# EAGLE design Moror_Driver_and_Power_Board_v2 (EAGLE 8.6.3)
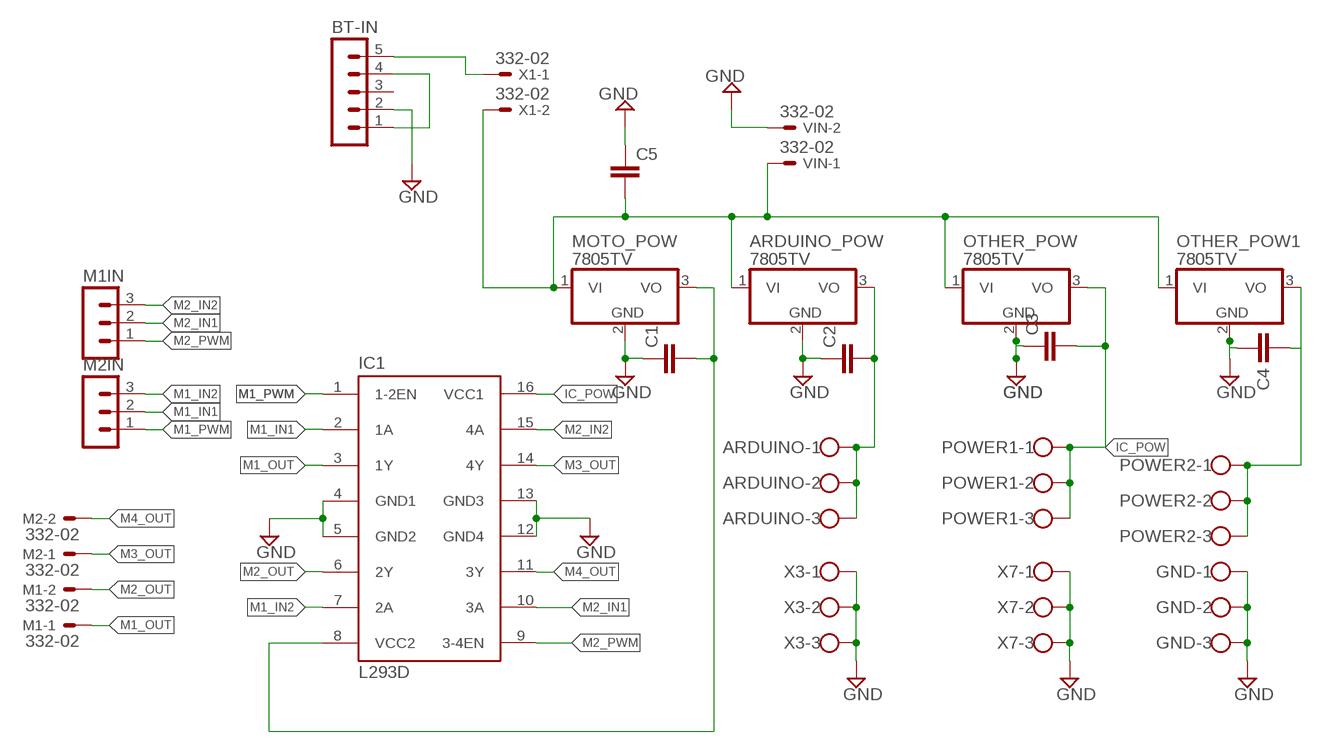
[diagram p0: schematic, sheet 1]

## Parts
ARDUINO  W237-103  [W237-103]
ARDUINO_POW  7805TV  [TO220V]
BT-IN  MA05-1  [MA05-1]
C1  C-EU025-030X050  [C025-030X050]
C2  C-EU025-030X050  [C025-030X050]
C3  C-EU025-030X050  [C025-030X050]
C4  C-EU025-030X050  [C025-030X050]
C5  C-EU025-030X050  [C025-030X050]
GND  W237-103  [W237-103]
IC1  L293D  [DIL16]
M1  332-02  [332-02]
M1IN  MA03-1  [MA03-1]
M2  332-02  [332-02]
M2IN  MA03-1  [MA03-1]
MOTO_POW  7805TV  [TO220V]
OTHER_POW  7805TV  [TO220V]
OTHER_POW1  7805TV  [TO220V]
POWER1  W237-103  [W237-103]
POWER2  W237-103  [W237-103]
VIN  332-02  [332-02]
X1  332-02  [332-02]
X3  W237-103  [W237-103]
X7  W237-103  [W237-103]

## Nets
GND: ARDUINO_POW.2(GND) BT-IN.2 C1.1 C2.1 C3.1 C4.1 C5.1 GND.1 GND.2 GND.3 IC1.4(GND1) IC1.5(GND2) IC1.12(GND4) IC1.13(GND3) MOTO_POW.2(GND) OTHER_POW1.2(GND) OTHER_POW.2(GND) VIN.2 X3.1 X3.2 X3.3 X7.1 X7.2 X7.3
IC_POW: C3.2 IC1.16(VCC1) OTHER_POW.3(VO) POWER1.1 POWER1.2 POWER1.3
M1_IN1: IC1.2(1A) M2IN.2
M1_IN2: IC1.7(2A) M2IN.3
M1_OUT: IC1.3(1Y) M1.1
M1_PWM: IC1.1(1-2EN) M2IN.1
M2_IN1: IC1.10(3A) M1IN.2
M2_IN2: IC1.15(4A) M1IN.3
M2_OUT: IC1.6(2Y) M1.2
M2_PWM: IC1.9(3-4EN) M1IN.1
M3_OUT: IC1.14(4Y) M2.1
M4_OUT: IC1.11(3Y) M2.2
N$1: ARDUINO_POW.1(VI) C5.2 MOTO_POW.1(VI) OTHER_POW1.1(VI) OTHER_POW.1(VI) VIN.1 X1.2
N$2: BT-IN.1 BT-IN.4
N$3: BT-IN.5 X1.1
N$4: C1.2 IC1.8(VCC2) MOTO_POW.3(VO)
N$5: C4.2 OTHER_POW1.3(VO) POWER2.1 POWER2.2 POWER2.3
VCC: ARDUINO.1 ARDUINO.2 ARDUINO.3 ARDUINO_POW.3(VO) C2.2
Unconnected: BT-IN.3

## Library data of the parts
ARDUINO GND POWER1 POWER2 X3 X7 = con-wago-500:W237-103: WAGO SCREW CLAMP; MPN: 237-103; OC_FARNELL: unknown; OC_NEWARK: 18M7116
ARDUINO_POW MOTO_POW OTHER_POW OTHER_POW1 = linear:78*: Positive VOLTAGE REGULATOR Source: http://cache.national.com/ds/LM/LM78L05.pdf http://www.fairchildsemi.com/ds/LM/LM7805.pdf
BT-IN = con-lstb:MA05-1: PIN HEADER; OC_FARNELL: unknown; OC_NEWARK: unknown
C1-C5 = rcl:C-EU: CAPACITOR, European symbol; SPICEPREFIX: C
IC1 = st-microelectronics:L293D: PUSH-PULL 4 CHANNEL DRIVER; MPN: L293D; OC_FARNELL: 9589619; OC_NEWARK: 56P8249
M1 M2 VIN X1 = con-garry:332-02: 2 Pin - 2mm Dual Row Source: www.mpe-connector.de / garry_shortform_2012.pdf
M1IN M2IN = con-lstb:MA03-1: PIN HEADER; OC_FARNELL: unknown; OC_NEWARK: unknown

## Board
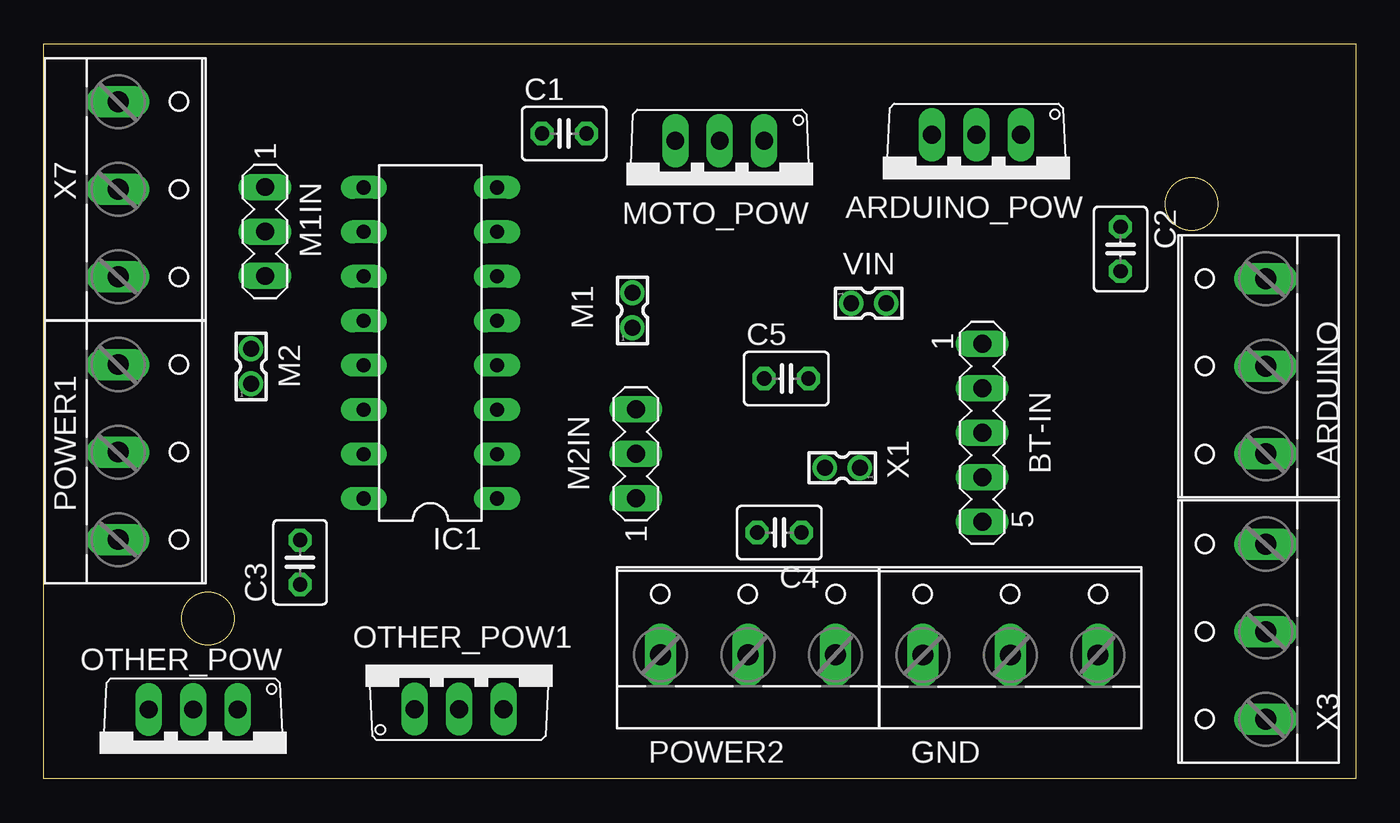
[diagram p1: board, top side]
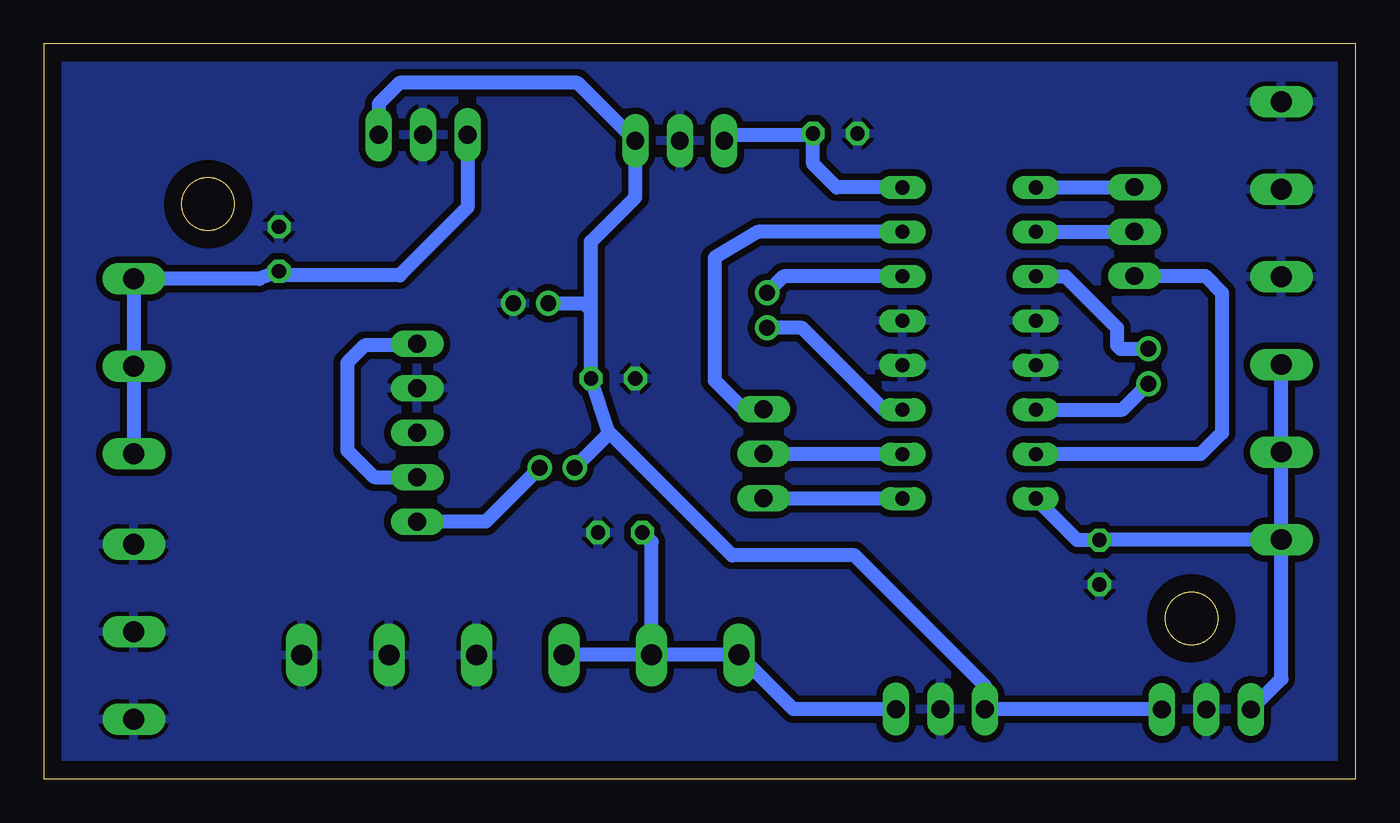
[diagram p2: board, bottom side, seen from below]

Size 75 x 42 mm. Coordinates in mm from the lower left corner, seen from the top.
Outline: 0,42 75,42 75,0 0,0 0,42
Outline: circle at 9.39,9.16 radius 1.5
Outline: circle at 65.61,32.84 radius 1.5
Copper layers (1*16): Top 0.035mm / dielectric 1.5mm / Bottom 0.035mm
Design rules "default *": minimum track width 6mil, minimum drill 0.35mm, track to track 15mil, track to pad 15mil, pad to pad 15mil, via to via 15mil, smd to smd 15mil, copper to edge 40mil, drill to drill 6mil, minimum pad ring 10mil, minimum via ring 8mil, stop-mask expansion 4mil, vias tented up to drill 0mil, thermal gap 10mil

### Footprints (pad centres in the part's own frame; a part is rotated, then mirrored left to right if it is on the bottom)
W237-103 = drill 1.194 long: 1 -5,-1.29; 2 0,-1.29; 3 5,-1.29
TO220V = drill 1.016 long: 1 -2.54,-2.54; 2 0,-2.54; 3 2.54,-2.54
MA05-1 = drill 1.016 long: 1 -5.08,0; 2 -2.54,0; 3 0,0; 4 2.54,0; 5 5.08,0
C025-030X050 = drill 0.813 octagon: 1 -1.27,0; 2 1.27,0
DIL16 = drill 0.813 long: 1 -8.89,-3.81; 2 -6.35,-3.81; 3 -3.81,-3.81; 4 -1.27,-3.81; 5 1.27,-3.81; 6 3.81,-3.81; 7 6.35,-3.81; 8 8.89,-3.81; 9 8.89,3.81; 10 6.35,3.81; 11 3.81,3.81; 12 1.27,3.81; 13 -1.27,3.81; 14 -3.81,3.81; 15 -6.35,3.81; 16 -8.89,3.81
332-02 = drill 0.9 pad 1.27: 1 0,-1; 2 0,1
MA03-1 = drill 1.016 long: 1 -2.54,0; 2 0,0; 3 2.54,0

### Placement (x,y rotation side)
ARDUINO  68.56,23.57 90 top
ARDUINO_POW  53.31,34.26 180 top
BT-IN  53.65,19.77 270 top
C1  29.75,36.87 0 top
C2  61.55,30.27 270 top
C3  14.65,12.37 90 top
C4  42.05,14.07 180 top
C5  42.45,22.87 0 top
GND  55.25,8.36 0 top
IC1  22.1,24.9 90 top
M1  33.65,26.77 0 top
M1IN  12.65,31.27 270 top
M2  11.85,23.57 0 top
M2IN  33.85,18.57 90 top
MOTO_POW  38.64,33.92 180 top
OTHER_POW  8.54,1.42 180 top
OTHER_POW1  23.74,6.52 0 top
POWER1  5.54,18.67 270 top
POWER2  40.25,8.37 0 top
VIN  47.15,27.17 270 top
X1  45.65,17.77 90 top
X3  68.56,8.41 90 top
X7  5.54,33.69 270 top

### Tracks (layer width: path | path; a pad name or v marks a point on that pad's centre or on a via)
GND
  pour Bottom: -2.35,42.77 -2.35,-1.23 76.65,-1.23 76.65,44.77 75.65,44.77 -2.35,44.77
IC_POW
  Bottom 0.813: OTHER_POW.3 4.25,5.71 POWER1.3 | POWER1.3 POWER1.2 POWER1.1 | POWER1.3 14.62,13.67 C3.2 15.92,13.64 IC1.16
M1_IN1
  Bottom 0.813: M2IN.2 25.93,18.57 IC1.2
M1_IN2
  Bottom 0.813: IC1.7 34.17,31.25 36.65,29.77 36.65,22.77 34.99,21.11 M2IN.3
M1_OUT
  Bottom 0.813: IC1.3 26.97,21.09 31.65,25.77 M1.1
M1_PWM
  Bottom 0.813: IC1.1 33.83,16.01 M2IN.1
M2_IN1
  Bottom 0.813: IC1.10 12.67,31.25 M1IN.2
M2_IN2
  Bottom 0.813: M1IN.3 8.61,28.73 7.65,27.77 7.65,19.77 8.87,18.55 IC1.15
M2_OUT
  Bottom 0.813: IC1.6 32.71,28.71 M1.2
M2_PWM
  Bottom 0.813: IC1.9 12.67,33.79 M1IN.1
M3_OUT
  Bottom 0.813: IC1.14 13.33,21.09 M2.1
M4_OUT
  Bottom 0.813: IC1.11 16.59,28.71 13.65,25.77 13.65,24.77 13.45,24.57 M2.2
N$1
  Bottom 0.813: ARDUINO_POW.1 55.85,38.57 54.65,39.77 44.49,39.77 MOTO_POW.1 41.18,33.24 43.72,30.7 43.72,26.77 | OTHER_POW.1 21.18,3.96 OTHER_POW1.1 21.2,5.32 28.65,12.77 35.65,12.77 42.65,19.77 | 42.65,19.77 42.72,19.84 C5.2 43.72,26.77 | X1.2 42.65,19.77 | VIN.1 44.12,27.17 43.72,26.77
N$2
  Bottom 0.813: BT-IN.1 53.73,24.77 56.65,24.77 57.65,23.77 57.65,18.77 56.11,17.23 BT-IN.4
N$3
  Bottom 0.813: X1.1 49.73,14.69 BT-IN.5
N$4
  Bottom 0.813: IC1.8 29.67,33.79 31.02,35.14 C1.2 31.12,36.77 35.79,36.77 MOTO_POW.3
N$5
  Bottom 0.813: POWER2.2 POWER2.1 32.15,3.98 OTHER_POW1.3 | POWER2.2 POWER2.3 | POWER2.2 40.25,13.54 C4.2
VCC
  Bottom 0.813: ARDUINO.1 ARDUINO.2 ARDUINO.3 62.68,28.57 C2.2 61.32,28.77 54.65,28.77 50.77,32.65 ARDUINO_POW.3